# Altium schematic sheet STM32L071KZ.SchDoc
size A4
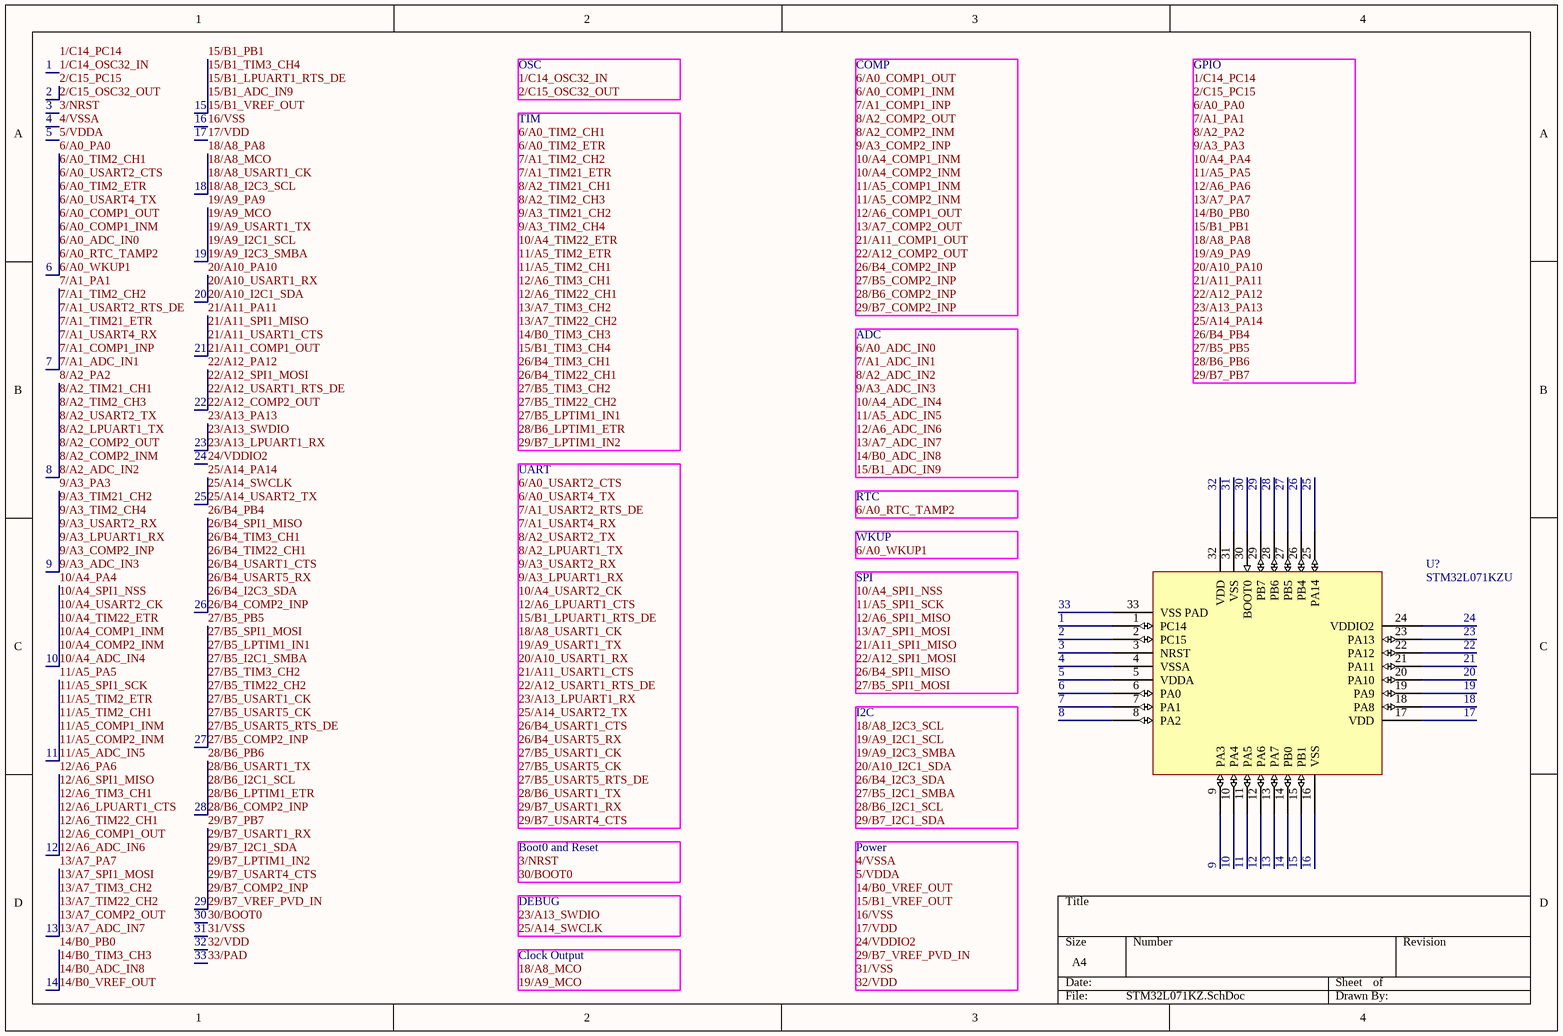
[diagram p0: STM32L071KZ.SchDoc]

## Parts
U?  STM32L071KZU  [UFQFPN32]

## Nets
1: U?.1(PC14)  [also labelled 1/C14_OSC32_IN]
2: U?.2(PC15)  [also labelled 2/C15_OSC32_OUT, 2/C15_PC15]
3: U?.3(NRST)  [also labelled 3/NRST]
4: U?.4(VSSA)  [also labelled 4/VSSA]
5: U?.5(VDDA)  [also labelled 5/VDDA]
6: U?.6(PA0)  [also labelled 6/A0_ADC_IN0, 6/A0_COMP1_INM, 6/A0_COMP1_OUT, 6/A0_PA0, 6/A0_RTC_TAMP2, 6/A0_TIM2_CH1, 6/A0_TIM2_ETR, 6/A0_USART2_CTS, 6/A0_USART4_TX, 6/A0_WKUP1]
7: U?.7(PA1)  [also labelled 7/A1_ADC_IN1, 7/A1_COMP1_INP, 7/A1_PA1, 7/A1_TIM21_ETR, 7/A1_TIM2_CH2, 7/A1_USART2_RTS_DE, 7/A1_USART4_RX]
8: U?.8(PA2)  [also labelled 8/A2_ADC_IN2, 8/A2_COMP2_INM, 8/A2_COMP2_OUT, 8/A2_LPUART1_TX, 8/A2_PA2, 8/A2_TIM21_CH1, 8/A2_TIM2_CH3, 8/A2_USART2_TX]
9: U?.9(PA3)  [also labelled 9/A3_ADC_IN3, 9/A3_COMP2_INP, 9/A3_LPUART1_RX, 9/A3_PA3, 9/A3_TIM21_CH2, 9/A3_TIM2_CH4, 9/A3_USART2_RX]
10: U?.10(PA4)  [also labelled 10/A4_ADC_IN4, 10/A4_COMP1_INM, 10/A4_COMP2_INM, 10/A4_PA4, 10/A4_SPI1_NSS, 10/A4_TIM22_ETR, 10/A4_USART2_CK]
11: U?.11(PA5)  [also labelled 11/A5_ADC_IN5, 11/A5_COMP1_INM, 11/A5_COMP2_INM, 11/A5_PA5, 11/A5_SPI1_SCK, 11/A5_TIM2_CH1, 11/A5_TIM2_ETR]
12: U?.12(PA6)  [also labelled 12/A6_ADC_IN6, 12/A6_COMP1_OUT, 12/A6_LPUART1_CTS, 12/A6_PA6, 12/A6_SPI1_MISO, 12/A6_TIM22_CH1, 12/A6_TIM3_CH1]
13: U?.13(PA7)  [also labelled 13/A7_ADC_IN7, 13/A7_COMP2_OUT, 13/A7_PA7, 13/A7_SPI1_MOSI, 13/A7_TIM22_CH2, 13/A7_TIM3_CH2]
14: U?.14(PB0)  [also labelled 14/B0_ADC_IN8, 14/B0_PB0, 14/B0_TIM3_CH3, 14/B0_VREF_OUT]
15: U?.15(PB1)  [also labelled 15/B1_ADC_IN9, 15/B1_LPUART1_RTS_DE, 15/B1_PB1, 15/B1_TIM3_CH4, 15/B1_VREF_OUT]
16: U?.16(VSS)  [also labelled 16/VSS]
17: U?.17(VDD)  [also labelled 17/VDD]
18: U?.18(PA8)  [also labelled 18/A8_I2C3_SCL, 18/A8_MCO, 18/A8_PA8, 18/A8_USART1_CK]
19: U?.19(PA9)  [also labelled 19/A9_I2C1_SCL, 19/A9_I2C3_SMBA, 19/A9_MCO, 19/A9_PA9, 19/A9_USART1_TX]
20: U?.20(PA10)  [also labelled 20/A10_I2C1_SDA, 20/A10_PA10, 20/A10_USART1_RX]
21: U?.21(PA11)  [also labelled 21/A11_COMP1_OUT, 21/A11_PA11, 21/A11_SPI1_MISO, 21/A11_USART1_CTS]
22: U?.22(PA12)  [also labelled 22/A12_COMP2_OUT, 22/A12_PA12, 22/A12_SPI1_MOSI, 22/A12_USART1_RTS_DE]
23: U?.23(PA13)  [also labelled 23/A13_LPUART1_RX, 23/A13_PA13, 23/A13_SWDIO]
24: U?.24(VDDIO2)  [also labelled 24/VDDIO2]
25: U?.25(PA14)  [also labelled 25/A14_PA14, 25/A14_SWCLK, 25/A14_USART2_TX]
26: U?.26(PB4)  [also labelled 26/B4_COMP2_INP, 26/B4_I2C3_SDA, 26/B4_PB4, 26/B4_SPI1_MISO, 26/B4_TIM22_CH1, 26/B4_TIM3_CH1, 26/B4_USART1_CTS, 26/B4_USART5_RX]
27: U?.27(PB5)  [also labelled 27/B5_COMP2_INP, 27/B5_I2C1_SMBA, 27/B5_LPTIM1_IN1, 27/B5_PB5, 27/B5_SPI1_MOSI, 27/B5_TIM22_CH2, 27/B5_TIM3_CH2, 27/B5_USART1_CK, 27/B5_USART5_CK, 27/B5_USART5_RTS_DE]
28: U?.28(PB6)  [also labelled 28/B6_COMP2_INP, 28/B6_I2C1_SCL, 28/B6_LPTIM1_ETR, 28/B6_PB6, 28/B6_USART1_TX]
29: U?.29(PB7)  [also labelled 29/B7_COMP2_INP, 29/B7_I2C1_SDA, 29/B7_LPTIM1_IN2, 29/B7_PB7, 29/B7_USART1_RX, 29/B7_USART4_CTS, 29/B7_VREF_PVD_IN]
30: U?.30(BOOT0)  [also labelled 30/BOOT0]
31: U?.31(VSS)  [also labelled 31/VSS]
32: U?.32(VDD)  [also labelled 32/VDD]
33: U?.33(VSS_PAD)  [also labelled 33/PAD]

## Notes on the sheet
- OSC
- COMP
- GPIO
- TIM
- ADC
- UART
- RTC
- WKUP
- SPI
- I2C
- Boot0 and Reset
- Power
- DEBUG
- Clock Output
- Labels drawn without touching a wire or pin: 1/C14_OSC32_IN, 1/C14_PC14, 2/C15_OSC32_OUT, 2/C15_PC15, 3/NRST, 4/VSSA, 5/VDDA, 6/A0_ADC_IN0, 6/A0_COMP1_INM, 6/A0_COMP1_OUT, 6/A0_PA0, 6/A0_RTC_TAMP2, 6/A0_TIM2_CH1, 6/A0_TIM2_ETR, 6/A0_USART2_CTS, 6/A0_USART4_TX, 6/A0_WKUP1, 7/A1_ADC_IN1, 7/A1_COMP1_INP, 7/A1_PA1, 7/A1_TIM2_CH2, 7/A1_TIM21_ETR, 7/A1_USART2_RTS_DE, 7/A1_USART4_RX, 8/A2_ADC_IN2, 8/A2_COMP2_INM, 8/A2_COMP2_OUT, 8/A2_LPUART1_TX, 8/A2_PA2, 8/A2_TIM2_CH3, 8/A2_TIM21_CH1, 8/A2_USART2_TX, 9/A3_ADC_IN3, 9/A3_COMP2_INP, 9/A3_LPUART1_RX, 9/A3_PA3, 9/A3_TIM2_CH4, 9/A3_TIM21_CH2, 9/A3_USART2_RX, 10/A4_ADC_IN4, 10/A4_COMP1_INM, 10/A4_COMP2_INM, 10/A4_PA4, 10/A4_SPI1_NSS, 10/A4_TIM22_ETR, 10/A4_USART2_CK, 11/A5_ADC_IN5, 11/A5_COMP1_INM, 11/A5_COMP2_INM, 11/A5_PA5, 11/A5_SPI1_SCK, 11/A5_TIM2_CH1, 11/A5_TIM2_ETR, 12/A6_ADC_IN6, 12/A6_COMP1_OUT, 12/A6_LPUART1_CTS, 12/A6_PA6, 12/A6_SPI1_MISO, 12/A6_TIM3_CH1, 12/A6_TIM22_CH1, 13/A7_ADC_IN7, 13/A7_COMP2_OUT, 13/A7_PA7, 13/A7_SPI1_MOSI, 13/A7_TIM3_CH2, 13/A7_TIM22_CH2, 14/B0_ADC_IN8, 14/B0_PB0, 14/B0_TIM3_CH3, 14/B0_VREF_OUT, 15/B1_ADC_IN9, 15/B1_LPUART1_RTS_DE, 15/B1_PB1, 15/B1_TIM3_CH4, 15/B1_VREF_OUT, 16/VSS, 17/VDD, 18/A8_I2C3_SCL, 18/A8_MCO, 18/A8_PA8, 18/A8_USART1_CK, 19/A9_I2C1_SCL, 19/A9_I2C3_SMBA, 19/A9_MCO, 19/A9_PA9, 19/A9_USART1_TX, 20/A10_I2C1_SDA, 20/A10_PA10, 20/A10_USART1_RX, 21/A11_COMP1_OUT, 21/A11_PA11, 21/A11_SPI1_MISO, 21/A11_USART1_CTS, 22/A12_COMP2_OUT, 22/A12_PA12, 22/A12_SPI1_MOSI, 22/A12_USART1_RTS_DE, 23/A13_LPUART1_RX, 23/A13_PA13, 23/A13_SWDIO, 24/VDDIO2, 25/A14_PA14, 25/A14_SWCLK, 25/A14_USART2_TX, 26/B4_COMP2_INP, 26/B4_I2C3_SDA, 26/B4_PB4, 26/B4_SPI1_MISO, 26/B4_TIM3_CH1, 26/B4_TIM22_CH1, 26/B4_USART1_CTS, 26/B4_USART5_RX, 27/B5_COMP2_INP, 27/B5_I2C1_SMBA, 27/B5_LPTIM1_IN1, 27/B5_PB5, 27/B5_SPI1_MOSI, 27/B5_TIM3_CH2, 27/B5_TIM22_CH2, 27/B5_USART1_CK, 27/B5_USART5_CK, 27/B5_USART5_RTS_DE, 28/B6_COMP2_INP, 28/B6_I2C1_SCL, 28/B6_LPTIM1_ETR, 28/B6_PB6, 28/B6_USART1_TX, 29/B7_COMP2_INP, 29/B7_I2C1_SDA, 29/B7_LPTIM1_IN2, 29/B7_PB7, 29/B7_USART1_RX, 29/B7_USART4_CTS, 29/B7_VREF_PVD_IN, 30/BOOT0, 31/VSS, 32/VDD

## Library data of the parts
U? = STM32L071KZU: Cortex M0+ Low Power; Designator: U?; Code: ISR02010255; Bus width: 32; Voltage: 1V65-3V6; Voltage max: 4; FLASH: 64k; SRAM: 20k; Part Number: STM32L071KZU; Part Type: MCU; Value: STM32L071KZU; Library path: SIMBOLS_CPU_MCU.SCHLIB; Footprint path: FootprintsPersonals.PcbLib